# EAGLE design telemetry-phoenix (EAGLE 7.7.0)
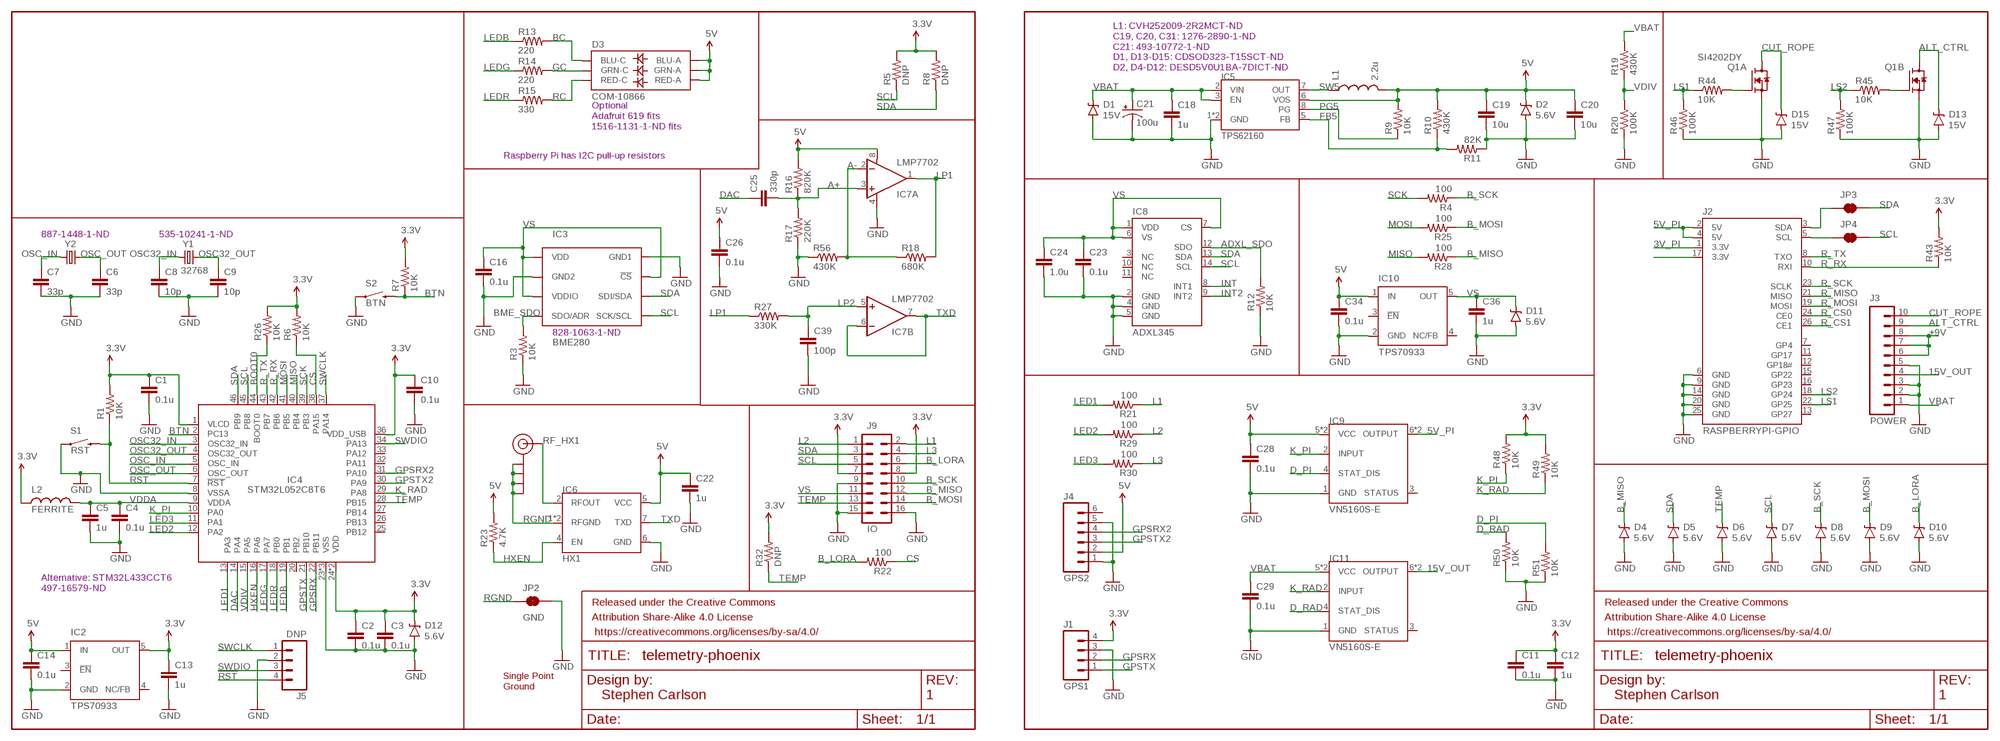
[diagram p0: schematic, sheet 1]

## Parts
C1  0.1u  CAP0805  [0805]
C2  0.1u  CAP0805  [0805]
C3  0.1u  CAP0805  [0805]
C4  0.1u  CAP0805  [0805]
C5  1u  CAP0805  [0805]
C6  33p  CAP0805  [0805]
C7  33p  CAP0805  [0805]
C8  10p  CAP0805  [0805]
C9  10p  CAP0805  [0805]
C10  0.1u  CAP0805  [0805]
C11  0.1u  CAP0805  [0805]
C12  1u  CAP0805  [0805]
C13  1u  CAP0805  [0805]
C14  0.1u  CAP0805  [0805]
C16  0.1u  CAP0805  [0805]
C18  1u  CAP0805  [0805]
C19  10u  CAP0805  [0805]
C20  10u  CAP0805  [0805]
C21  100u  CAP_POLE  [PANASONIC_E]
C22  1u  CAP0805  [0805]
C23  0.1u  CAP0805  [0805]
C24  1.0u  CAP0805  [0805]
C25  330p  CAP0805  [0805]
C26  0.1u  CAP0805  [0805]
C28  0.1u  CAP0805  [0805]
C29  0.1u  CAP0805  [0805]
C34  0.1u  CAP0805  [0805]
C36  1u  CAP0805  [0805]
C39  100p  CAP0805  [0805]
D1  15V  DIODE-ZENER5.6V  [SOD-323]
D2  5.6V  DIODE-ZENER5.6V  [SOD-323]
D3  COM-10866  LED-TRICOLOR-5050NO_IC  [LED-TRICOLOR-5050]
D4  5.6V  DIODE-ZENER5.6V  [SOD-323]
D5  5.6V  DIODE-ZENER5.6V  [SOD-323]
D6  5.6V  DIODE-ZENER5.6V  [SOD-323]
D7  5.6V  DIODE-ZENER5.6V  [SOD-323]
D8  5.6V  DIODE-ZENER5.6V  [SOD-323]
D9  5.6V  DIODE-ZENER5.6V  [SOD-323]
D10  5.6V  DIODE-ZENER5.6V  [SOD-323]
D11  5.6V  DIODE-ZENER5.6V  [SOD-323]
D12  5.6V  DIODE-ZENER5.6V  [SOD-323]
D13  15V  DIODE-ZENER5.6V  [SOD-323]
D15  15V  DIODE-ZENER5.6V  [SOD-323]
FRAME1  FRAME-LETTERNO_PACKAGE  [DUMMY]
FRAME2  FRAME-LETTERNO_PACKAGE  [DUMMY]
IC2  TPS70933  TPS77033  [SOT23-DBV]
IC3  BME280  [BME280_LGA]
IC4  STM32L052C8T6  STM32L07C  [TQFP48]
IC5  TPS62160  [MSOP8]
IC6  HX1  [HX1]
IC7  LMP7702  OPAMP-DUALU  [SO08]
IC8  ADXL345  [LGA14]
IC9  VN5160S-E  [SO8]
IC10  TPS70933  TPS77033  [SOT23-DBV]
IC11  VN5160S-E  [SO8]
J1  GPS1  M04PTH  [1X04]
J2  RASPBERRYPI-GPIO  [2X13-PI]
J3  POWER  1X10  [1X10_SCREW]
J4  GPS2  M06SMD-1MM  [1X06-1MM]
J5  DNP  M04LOCK  [1X04_LOCK]
J6  SMA_EDGE  [SMA-EDGE]
J9  IO  M08X2  [2X8]
JP2  GND  JUMPER-PAD-2-NC_BY_TRACE  [PAD-JUMPER-2-NC_BY_TRACE_YES_SILK]
JP3  SDA  JUMPER-PAD-2-NC_BY_TRACE  [PAD-JUMPER-2-NC_BY_TRACE_YES_SILK]
JP4  SCL  JUMPER-PAD-2-NC_BY_TRACE  [PAD-JUMPER-2-NC_BY_TRACE_YES_SILK]
L1  2.2u  INDUCTOR1008  [1008]
L2  FERRITE  INDUCTOR1206  [1206]
Q1  SI4202DY  [SO8]
R1  10K  RESISTOR0805-RES  [0805]
R3  10K  RESISTOR0805-RES  [0805]
R4  100  RESISTOR0805-RES  [0805]
R5  DNP  RESISTOR0805-RES  [0805]
R6  10K  RESISTOR0805-RES  [0805]
R7  10K  RESISTOR0805-RES  [0805]
R8  DNP  RESISTOR0805-RES  [0805]
R9  10K  RESISTOR0805-RES  [0805]
R10  430K  RESISTOR0805-RES  [0805]
R11  82K  RESISTOR0805-RES  [0805]
R12  10K  RESISTOR0805-RES  [0805]
R13  220  RESISTOR0805-RES  [0805]
R14  220  RESISTOR0805-RES  [0805]
R15  330  RESISTOR0805-RES  [0805]
R16  820K  RESISTOR0805-RES  [0805]
R17  220K  RESISTOR0805-RES  [0805]
R18  680K  RESISTOR0805-RES  [0805]
R19  430K  RESISTOR0805-RES  [0805]
R20  100K  RESISTOR0805-RES  [0805]
R21  100  RESISTOR0805-RES  [0805]
R22  100  RESISTOR0805-RES  [0805]
R23  4.7K  RESISTOR0805-RES  [0805]
R25  100  RESISTOR0805-RES  [0805]
R26  10K  RESISTOR0805-RES  [0805]
R27  330K  RESISTOR0805-RES  [0805]
R28  100  RESISTOR0805-RES  [0805]
R29  100  RESISTOR0805-RES  [0805]
R30  100  RESISTOR0805-RES  [0805]
R32  DNP  RESISTOR0805-RES  [0805]
R43  10K  RESISTOR0805-RES  [0805]
R44  10K  RESISTOR0805-RES  [0805]
R45  10K  RESISTOR0805-RES  [0805]
R46  100K  RESISTOR0805-RES  [0805]
R47  100K  RESISTOR0805-RES  [0805]
R48  10K  RESISTOR0805-RES  [0805]
R49  10K  RESISTOR0805-RES  [0805]
R50  10K  RESISTOR0805-RES  [0805]
R51  10K  RESISTOR0805-RES  [0805]
R56  430K  RESISTOR0805-RES  [0805]
S1  RST  SWITCH  [TACTILE-PTH-THIN]
S2  BTN  SWITCH  [TACTILE-PTH-THIN]
Y1  32768  CRYSTAL  [ABS25]
Y2  8M  CRYSTALTXC-7A  [CRYSTAL-TXC-7A]

## Nets
3.3V: C1.1 C2.1 C3.1 C10.1 C11.1 C12.1 C13.1 D12.C IC2.5(OUT) IC4.1(VLCD) IC4.24(VDD) IC4.36(VDD_USB) IC4.48(VDD) J1.4 J9.7 J9.8 L2.1 R1.2 R5.2 R6.2 R7.2 R8.2 R26.2 R32.2 R43.2 R48.2 R49.2
3V_PI: J2.1(3.3V)
3V_PI2: J2.17(3.3V)
5V: C14.1 C19.1 C20.1 C22.1 C26.1 C28.1 C34.1 D2.C D3.1(GRN-A) D3.2(RED-A) D3.3(BLU-A) IC2.1(IN) IC5.6(VOS) IC6.5(VCC) IC7.8(A:V+) IC9.5(VCC) IC9.8(VCC) IC10.1(IN) J4.2 L1.2 R9.2 R10.2 R16.2 R23.2
5V_PI: IC9.6(OUTPUT) IC9.7(OUTPUT) J2.2(5V) J2.4(5V)
15V_OUT: IC11.6(OUTPUT) IC11.7(OUTPUT) J3.4
!RST!: IC4.7(!RST!) J5.4 R1.1 S1.2
+9V: J3.6 J3.7 J3.8
A+: C25.2 IC7.3(A:+IN) R16.1 R17.2
A-: IC7.2(A:-IN) R18.1 R56.2
ACB: Q1.4(B:G) R45.2
ADXL_SDO: IC8.12(SDO) R12.2
ALT_CTRL: D13.C J3.9 Q1.5(B:D) Q1.6(B:D)
B_LORA: D10.C J9.6 R22.2
B_MISO: D4.C J9.12 R28.1
B_MOSI: D9.C J9.14 R25.1
B_SCK: D8.C J9.10 R4.1
BC: D3.4(BLU-C) R13.2
BME_SDO: IC3.P$5(SDO/ADR) R3.2
BOOT0: IC4.44(BOOT0) R26.1
BTN: IC4.2(PC13) R7.1 S2.2
CRB: Q1.2(A:G) R44.2
CS: IC4.38(PA15) R6.1 R22.1
CUT_ROPE: D15.C J3.10 Q1.7(A:D) Q1.8(A:D)
D_PI: IC9.4(STAT_DIS) R51.2
D_RAD: IC11.4(STAT_DIS) R50.2
DAC: C25.1 IC4.14(PA4)
FB5: IC5.5(FB) R10.1 R11.2
GC: D3.6(GRN-C) R14.2
GND: C1.2 C2.2 C3.2 C4.2 C5.2 C6.2 C7.2 C8.2 C9.2 C10.2 C11.2 C12.2 C13.2 C14.2 C16.2 C18.2 C19.2 C20.2 C21.- C22.2 C23.2 C24.2 C26.2 C28.2 C29.2 C34.2 C36.2 C39.2 D1.A D2.A D4.A D5.A D6.A D7.A D8.A D9.A D10.A D11.A D12.A D13.A D15.A IC2.2(GND) IC3.P$1(GND1) IC3.P$7(GND2) IC4.8(VSSA) IC4.23(VSS) IC4.35(VSS) IC4.47(VSS) IC5.1(GND) IC5.4(GND) IC6.6(GND) IC7.4(A:V-) IC8.2(GND) IC8.4(GND) IC8.5(GND) IC9.1(GND) IC10.2(GND) IC11.1(GND) J1.3 J2.6(GND) J2.9(GND) J2.14(GND) J2.20(GND) J2.25(GND) J3.2 J3.3 J3.5 J4.1 J4.5 J5.2 J9.9 J9.15 J9.16 JP2.2 Q1.1(A:S) Q1.3(B:S) R3.1 R11.1 R12.1 R17.1 R20.1 R46.1 R47.1 R50.1 R51.1 R56.1 S1.1 S2.1
GPSRX: IC4.22(PB11) J1.2
GPSRX2: IC4.31(PA10) J4.4
GPSTX: IC4.21(PB10) J1.1
GPSTX2: IC4.30(PA9) J4.3
HXEN: IC4.16(PA6) IC6.4(EN) R23.1
INT: IC8.8(INT1)
INT2: IC8.9(INT2)
K_PI: IC4.10(PA0) IC9.2(INPUT) R48.1
K_RAD: IC4.29(PA8) IC11.2(INPUT) R49.1
L1: J9.2 R21.1
L2: J9.1 R29.1
L3: J9.4 R30.1
LED1: IC4.13(PA3) R21.2
LED2: IC4.12(PA2) R29.2
LED3: IC4.11(PA1) R30.2
LEDB: IC4.19(PB1) R13.1
LEDG: IC4.17(PA7) R14.1
LEDR: IC4.18(PB0) R15.1
LP1: IC7.1(A:OUT) R18.2 R27.1
LP2: C39.1 IC7.5(B:+IN) R27.2
LS1: J2.22(GP25) R44.1 R46.2
LS2: J2.18(GP24) R45.1 R47.2
MISO: IC4.40(PB4) R28.2
MOSI: IC4.41(PB5) R25.2
OSC32_IN: C8.1 IC4.3(OSC32_IN) Y1.1
OSC32_OUT: C9.1 IC4.4(OSC32_OUT) Y1.4
OSC_IN: C7.1 IC4.5(OSC_IN) Y2.P$1
OSC_OUT: C6.1 IC4.6(OSC_OUT) Y2.P$2
PG5: IC5.8(PG) R9.1
R_CS0: J2.24(CE0)
R_CS1: J2.26(CE1)
R_MISO: J2.21(MISO)
R_MOSI: J2.19(MOSI)
R_RX: IC4.42(PB6) J2.10(RXI) R43.1
R_SCK: J2.23(SCLK)
R_SCL: J2.5(SCL) JP4.1
R_SDA: J2.3(SDA) JP3.1
R_TX: IC4.43(PB7) J2.8(TXO)
RC: D3.5(RED-C) R15.2
RF_HX1: IC6.2(RFOUT) J6.SIG(SIGNAL)
RGND: IC6.1(RFGND) IC6.3(RFGND) J6.GND@0(GND) J6.GND@1(GND) J6.GND@2(GND) J6.GND@3(GND) JP2.1
SCK: IC4.39(PB3) R4.2
SCL: D7.C IC3.P$4(SCK/SCL) IC4.45(PB8) IC8.14(SCL) J9.5 JP4.2 R5.1
SDA: D5.C IC3.P$3(SDI/SDA) IC4.46(PB9) IC8.13(SDA) J9.3 JP3.2 R8.1
SW5: IC5.7(OUT) L1.1
SWCLK: IC4.37(PA14) J5.1
SWDIO: IC4.34(PA13) J5.3
TEMP: D6.C IC4.28(PB15) J9.13 R32.1
TXD: IC6.7(TXD) IC7.6(B:-IN) IC7.7(B:OUT)
VBAT: C18.1 C21.+ C29.1 D1.C IC5.2(VIN) IC5.3(EN) IC11.5(VCC) IC11.8(VCC) J3.1 R19.2
VDDA: C4.1 C5.1 IC4.9(VDDA) L2.2
VDIV: IC4.15(PA5) R19.1 R20.2
VS: C16.1 C23.1 C24.1 C36.1 D11.C IC3.P$2(!CS) IC3.P$6(VDDIO) IC3.P$8(VDD) IC8.1(VDD) IC8.6(VS) IC8.7(CS) IC10.5(OUT) J9.11
Unconnected: IC2.3(!EN) IC2.4(NC/FB) IC4.20(PB2) IC4.25(PB12) IC4.26(PB13) IC4.27(PB14) IC4.32(PA11) IC4.33(PA12) IC8.3(NC) IC8.10(NC) IC8.11(NC) IC9.3(STATUS) IC10.3(!EN) IC10.4(NC/FB) IC11.3(STATUS) J2.7(GP4) J2.11(GP17) J2.12(GP18#) J2.13(GP27) J2.15(GP22) J2.16(GP23) J4.6

## Notes on the sheet
- L1: CVH252009-2R2MCT-ND
  C19, C20, C31: 1276-2890-1-ND
  C21: 493-10772-1-ND
  D1, D13-D15: CDSOD323-T15SCT-ND 
  D2, D4-D12: DESD5V0U1BA-7DICT-ND
- Optional
  Adafruit 619 fits
  1516-1131-1-ND fits
- Raspberry Pi has I2C pull-up resistors
- 887-1448-1-ND | 535-10241-1-ND
- 828-1063-1-ND
- Alternative: STM32L433CCT6
  497-16579-ND
- Single Point
  Ground
- Stephen Carlson | 1 | Stephen Carlson | 1

## Library data of the parts
C1-C14 C16 C18-C20 C22-C26 C28 C29 C34 C36 C39 = SparkFun-Passives:CAP: Capacitor Standard 0603 ceramic capacitor, and 0.1" leaded capacitor.
C21 = SparkFun-Passives:CAP_POL: Capacitor Polarized These are standard SMD and PTH capacitors. Normally 10uF, 47uF, and 100uF in electrolytic and tantalum varieties. Always verify the external diameter of the through hole cap, it varies with capacity, voltage, and manufacturer. The EIA devices should be standard.
D1 D13 D15 = SparkFun-DiscreteSemi:DIODE-ZENER: Zener Diode Production Part - 8199 3.4V Zener Voltage; PROD_ID: DIO-12442; VALUE: 5.6V
D2 D4-D12 = SparkFun-DiscreteSemi:DIODE-ZENER: Zener Diode Production Part - 8199 3.4V Zener Voltage; PROD_ID: DIO-12442
D3 = SparkFun-LED:LED-TRICOLOR-5050
FRAME1 FRAME2 = SparkFun-Aesthetics:FRAME-LETTER: Schematic Frame Standard 8.5x11 US Letter frame; DESIGNER: Nobody; VERSION: v01
IC2 IC10 = texas:TPS770*: ULTRALOW-POWER 50-mA LOW-DROPOUT LINEAR REGULATORS 50-mA Low-Dropout Regulator Source: http://focus.ti.com/lit/ds/symlink/tps77001.pdf; MF: TEXAS INSTRUMENTS; MPN: TPS77033DBVT; OC_FARNELL: 8461570; OC_NEWARK: 77C1187
IC3 = BME280ComponentLibrary:BME280; PROD_ID: IC-13090
IC4 = stm32xx:STM32L07*C: STM32L07XC STM32L07X series in LQFP-48 package
IC5 = HAB:TPS62160: TPS62160 Adjustable switch-mode D-CAP2 regulator
IC6 = HAB:HX1: Radiometrix HX1 High-power VHF Narrow Band 300 mW Transmitter
IC7 = SparkFun-AnalogIC:OPAMP-DUAL: Generic op-amp footprint
IC8 = SparkFun-Sensors:ADXL345: 3-axis SPI/I2C 2/4/8/16g accelerometer
IC9 IC11 = HAB:VN5160S-E: VN5160S-E Single channel high side driver for automotive applications
J1 J5 = SparkFun-Connectors:M04: Header 4 Standard 4-pin 0.1" header. Use with straight break away headers (SKU : PRT-00116), right angle break away headers (PRT-00553), swiss pins (PRT-00743), machine pins (PRT-00117), and female headers (PRT-00115). Molex polarized connector foot print use with SKU : PRT-08231 with associated crimp pins and housings. 1MM SMD Version SKU: PRT-10208; PROD_ID: CONN-09696
J2 = HAB:RASPBERRYPI-GPIO: RASPBERRY PI I/O HEADER As defined for the Revision 2 Pi.
J3 = HAB:1X10: 1X10 10-pin header
J4 = SparkFun-Connectors:M06: Header 6 Standard 6-pin 0.1" header. Use with straight break away headers (SKU : PRT-00116), right angle break away headers (PRT-00553), swiss pins (PRT-00743), machine pins (PRT-00117), and female headers (PRT-00115). Molex polarized connector foot print use with SKU : PRT-08094 with associated crimp pins and housings. NOTES ON THE VARIANTS LOCK and LOCK_LONGPADS... This footprint was designed to help hold the alignment of a through-hole component (i.e. 6-pin header) while soldering it into place. You may notice that each hole has been shifted either up or down by 0.005 of an inch from it's more standard position (which is a perfectly straight line). This slight alteration caused the pins (the squares in the middle) to touch the edges of the holes. Because they are alternating, it causes a "brace" to hold the component in place. 0.005 has proven to be the perfect amount of "off-center" position when using our standard breakaway headers. Although looks a little odd when you look at the bare footprint, once you have a header in there, the alteration is very hard to notice. Also,if you push a header all the way into place, it is covered up entirely on the bottom side. This idea of altering the position of holes to aid alignment will be further integrated into the Sparkfun Library for other footprints. It can help hold any component with 3 or more connection pins.
J6 = SparkFun-Connectors:SMA_EDGE: SMA Antenna Connector End launch SMA connector. The paste layer has been removed so that the connector can be hand soldered onto the board after reflow.
J9 = SparkFun-Connectors:M08X2: .1" headers, two rows of 8 each
JP2-JP4 = SparkFun-Passives:JUMPER-PAD-2-NC_BY_TRACE
L1 L2 = HAB:INDUCTOR: INDUCTOR Standard inductor, with some new packages Why do inductors never come in standard packages!?
Q1 = HAB:SI4202DY: SI4202DY Dual N-Channel 30V (D-S) MOSFET
R1 R3-R23 R25-R30 R32 R43-R51 R56 = SparkFun-Passives:RESISTOR: Resistor Basic schematic elements and footprints for 0603, 1206, and PTH resistors.
S1 S2 = HAB:SWITCH: SWITCH Package for the MJTP1250, a thinner and lighter PTH push button switch.
Y1 = HAB:CRYSTAL: CRYSTAL Crystal oscillators in packages not in SparkFun-FreqCtl
Y2 = SparkFun-FreqCtrl:CRYSTAL: Various standard crystals. Proven footprints.

## Board
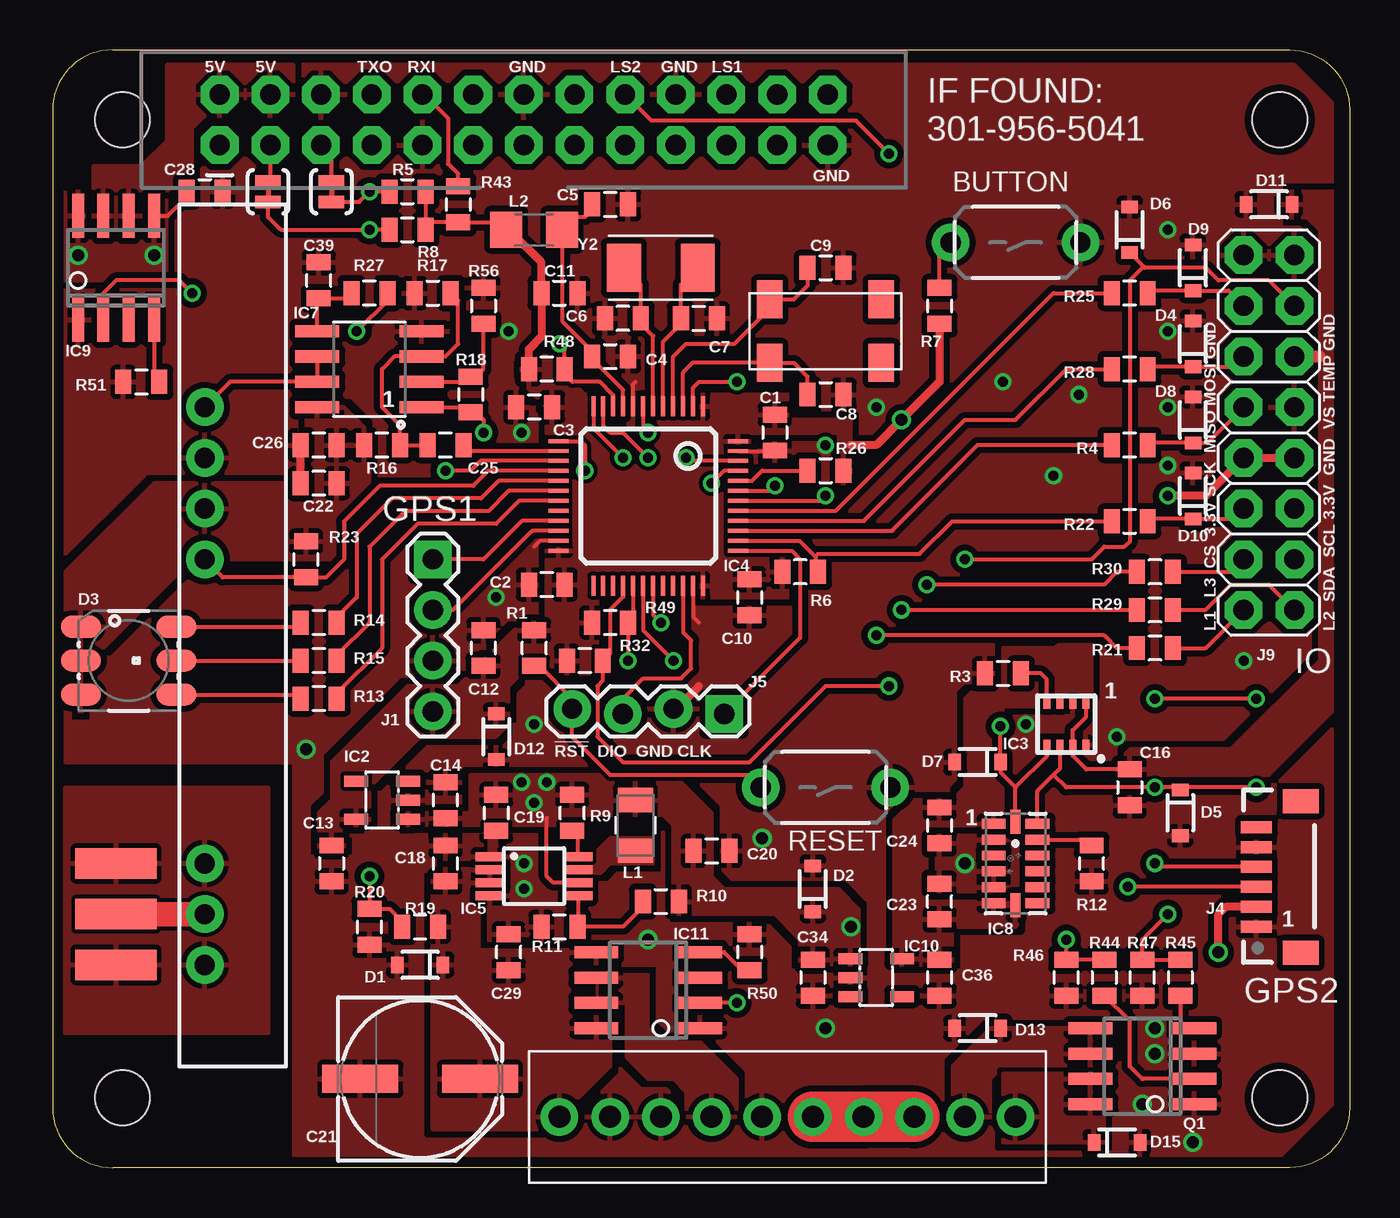
[diagram p1: board, top side]
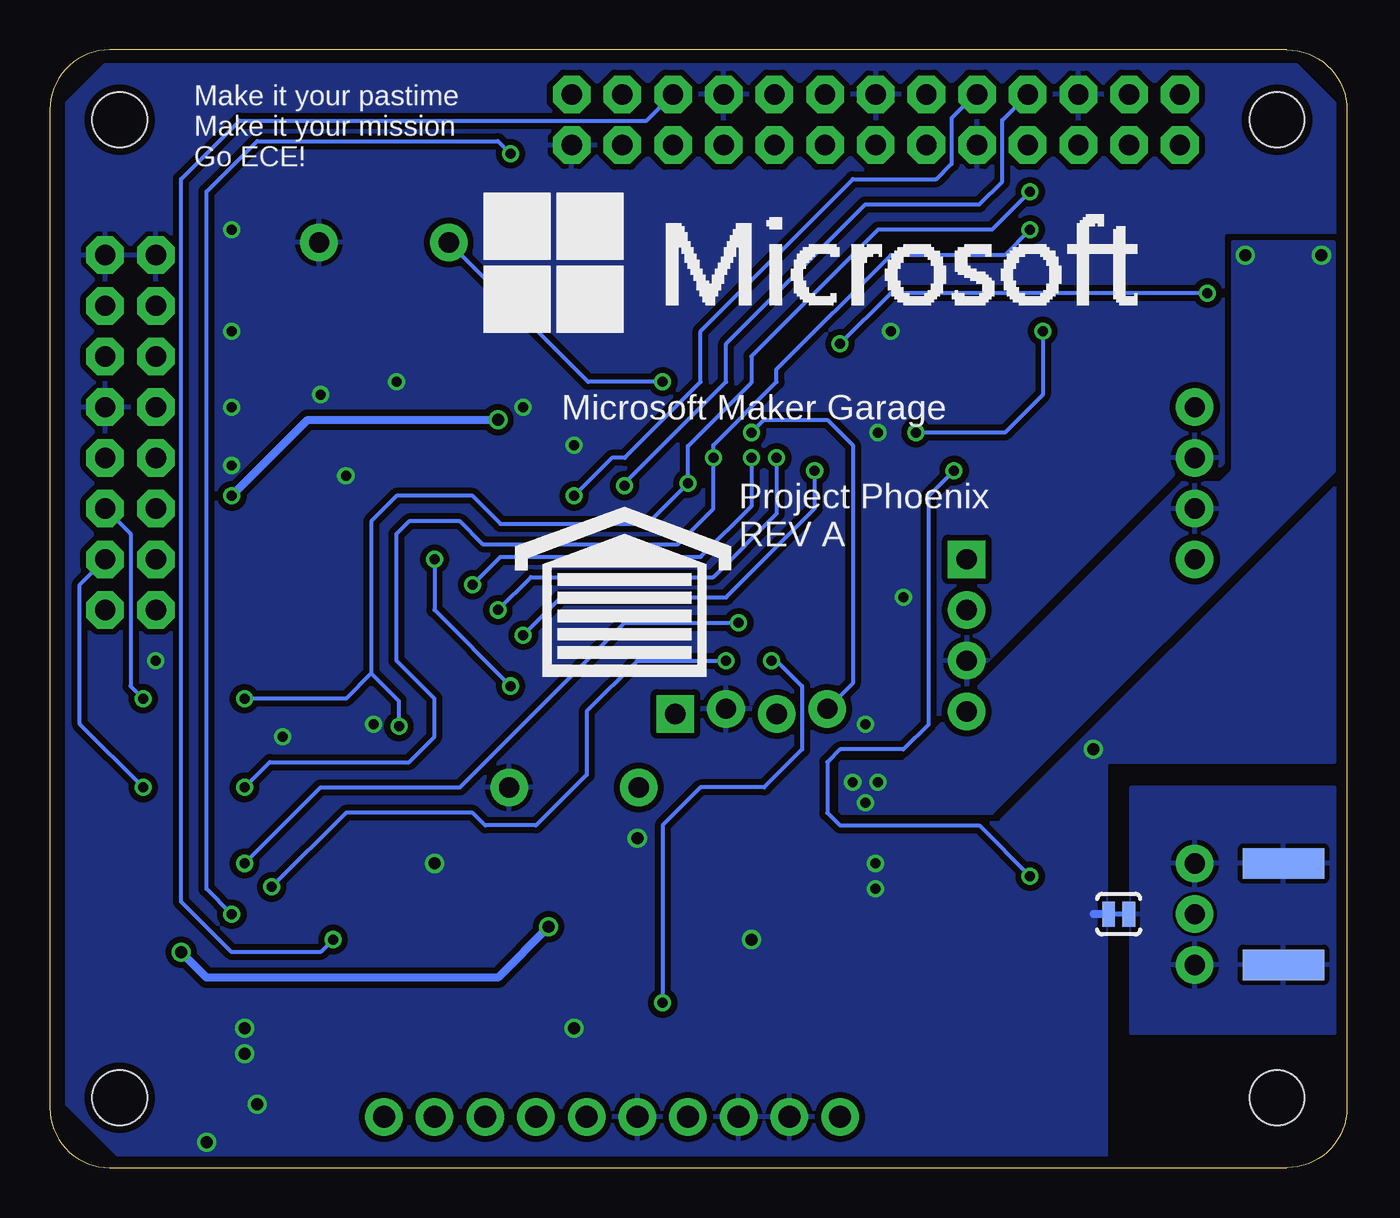
[diagram p2: board, bottom side, seen from below]

Size 65 x 56 mm. Coordinates in mm from the lower left corner, seen from the top.
Outline: 0,53 0,3 arc90 3,0 62,0 arc90 65,3 65,53 arc90 62,56 3,56 arc90 0,53
Copper layers (1*16): Top 0.0356mm / dielectric 1.5011mm / Bottom 0.0356mm
Design rules "LaenPCBOrder *": minimum track width 6mil, minimum drill 13mil, track to track 6mil, track to pad 6mil, pad to pad 6mil, via to via 6mil, smd to smd 6mil, copper to edge 15mil, drill to drill 6mil, minimum pad ring 7mil, minimum via ring 7mil, stop-mask expansion 2.5mil, vias tented up to drill 0mil, thermal gap 10mil
Holes 2.75 mm at 3.5,52.5 61.5,3.5 3.5,3.5 61.5,52.5
tKeepout: area 0.5,49.5 to 6.5,55.5; area 0.5,0.5 to 6.5,6.5; area 58.5,0.5 to 64.5,6.5; area 58.5,49.5 to 64.5,55.5

### Footprints (pad centres in the part's own frame; a part is rotated, then mirrored left to right if it is on the bottom)
0805 = smd 0.8 x 1.2: 1 -0.9,0; 2 0.9,0
PANASONIC_E = smd 3.8 x 1.4: + 3,0; - -3,0
SOD-323 = smd 0.63 x 0.83: A 1.15,0; C -1.15,0
LED-TRICOLOR-5050 = smd 2 x 1.1: 1 -2.4,1.7; 2 -2.4,0; 3 -2.4,-1.7; 4 2.4,-1.7; 5 2.4,0; 6 2.4,1.7
SOT23-DBV = smd 0.55 x 1.2: 1 -0.95,-1.3; 2 0,-1.3; 3 0.95,-1.3; 4 0.95,1.3; 5 -0.95,1.3
BME280_LGA = smd 0.5 x 0.35: P$1 1.025,0.975; P$2 1.025,0.325; P$3 1.025,-0.325; P$4 1.025,-0.975; P$5 -1.025,-0.975; P$6 -1.025,-0.325; P$7 -1.025,0.325; P$8 -1.025,0.975
TQFP48 = smd 0.2 x 1: 1 -2.75,-4.5; 2 -2.25,-4.5; 3 -1.75,-4.5; 4 -1.25,-4.5; 5 -0.75,-4.5; 6 -0.25,-4.5; 7 0.25,-4.5; 8 0.75,-4.5; 9 1.25,-4.5; 10 1.75,-4.5; 11 2.25,-4.5; 12 2.75,-4.5; 25 2.75,4.5; 26 2.25,4.5; 27 1.75,4.5; 28 1.25,4.5; 29 0.75,4.5; 30 0.25,4.5; 31 -0.25,4.5; 32 -0.75,4.5; 33 -1.25,4.5; 34 -1.75,4.5; 35 -2.25,4.5; 36 -2.75,4.5 | smd 1 x 0.2: 13 4.5,-2.75; 14 4.5,-2.25; 15 4.5,-1.75; 16 4.5,-1.25; 17 4.5,-0.75; 18 4.5,-0.25; 19 4.5,0.25; 20 4.5,0.75; 21 4.5,1.25; 22 4.5,1.75; 23 4.5,2.25; 24 4.5,2.75; 37 -4.5,2.75; 38 -4.5,2.25; 39 -4.5,1.75; 40 -4.5,1.25; 41 -4.5,0.75; 42 -4.5,0.25; 43 -4.5,-0.25; 44 -4.5,-0.75; 45 -4.5,-1.25; 46 -4.5,-1.75; 47 -4.5,-2.25; 48 -4.5,-2.75
MSOP8 = smd 0.45 x 1.45: 1 -0.975,-2.2; 2 -0.325,-2.2; 3 0.325,-2.2; 4 0.975,-2.2; 5 0.975,2.2; 6 0.325,2.2; 7 -0.325,2.2; 8 -0.975,2.2
HX1 = drill 1.016 pad 1.88: 1 0,0; 2 2.54,0; 3 5.08,0; 4 20.32,0; 5 22.86,0; 6 25.4,0; 7 27.94,0
SO08 = smd 0.61 x 2.21: 1 -1.905,-2.616; 2 -0.635,-2.616; 3 0.635,-2.616; 4 1.905,-2.616; 5 1.905,2.616; 6 0.635,2.616; 7 -0.635,2.616; 8 -1.905,2.616
LGA14 = smd 0.5 x 1.2: 1 2,1.1; 2 1.2,1.1; 3 0.4,1.1; 4 -0.4,1.1; 5 -1.2,1.1; 6 -2,1.1; 8 -2,-1.1; 9 -1.2,-1.1; 10 -0.4,-1.1; 11 0.4,-1.1; 12 1.2,-1.1; 13 2,-1.1 | smd 1.2 x 0.5: 7 -2.1,0; 14 2.1,0
SO8 = smd 0.6 x 2.2: 1 -1.905,-2.6; 2 -0.635,-2.6; 3 0.635,-2.6; 4 1.905,-2.6; 5 1.905,2.6; 6 0.635,2.6; 7 -0.635,2.6; 8 -1.905,2.6
1X04 = drill 1.016 pad 1.88 square: 1 0,0 | drill 1.016 pad 1.88: 2 2.54,0; 3 5.08,0; 4 7.62,0
2X13-PI = drill 1.016 pad 1.88 octagon: 1 -1.27,15.24; 2 1.27,15.24; 3 -1.27,12.7; 4 1.27,12.7; 5 -1.27,10.16; 6 1.27,10.16; 7 -1.27,7.62; 8 1.27,7.62; 9 -1.27,5.08; 10 1.27,5.08; 11 -1.27,2.54; 12 1.27,2.54; 13 -1.27,0; 14 1.27,0; 15 -1.27,-2.54; 16 1.27,-2.54; 17 -1.27,-5.08; 18 1.27,-5.08; 19 -1.27,-7.62; 20 1.27,-7.62; 21 -1.27,-10.16; 22 1.27,-10.16; 23 -1.27,-12.7; 24 1.27,-12.7; 25 -1.27,-15.24; 26 1.27,-15.24
1X10_SCREW = drill 1.1 pad 1.88: 1 0,0; 2 2.54,0; 3 5.08,0; 4 7.62,0; 5 10.16,0; 6 12.7,0; 7 15.24,0; 8 17.78,0; 9 20.32,0; 10 22.86,0
1X06-1MM = smd 0.6 x 1.55: 1 -2.54,1.27; 2 -1.54,1.27; 3 -0.54,1.27; 4 0.46,1.27; 5 1.46,1.27; 6 2.46,1.27 | smd 1.2 x 1.8: P$1 -3.84,-0.955; P$2 3.76,-0.955
1X04_LOCK = drill 1.016 pad 1.88 square: 1 0,0.127 | drill 1.016 pad 1.88: 2 2.54,-0.127; 3 5.08,0.127; 4 7.62,-0.127
SMA-EDGE = smd 1.524 x 4.064: GND@0 0,0; GND@1 5.08,0; SIG 2.54,0 | smd 1.524 x 4.064 bottom: GND@2 0,0; GND@3 5.08,0
2X8 = drill 1.016 pad 1.88 octagon: 1 0,0; 2 0,2.54; 3 2.54,0; 4 2.54,2.54; 5 5.08,0; 6 5.08,2.54; 7 7.62,0; 8 7.62,2.54; 9 10.16,0; 10 10.16,2.54; 11 12.7,0; 12 12.7,2.54; 13 15.24,0; 14 15.24,2.54; 15 17.78,0; 16 17.78,2.54
PAD-JUMPER-2-NC_BY_TRACE_YES_SILK = smd 0.635 x 1.27: 1 -0.508,0; 2 0.508,0
1008 = smd 1.753 x 1.219: 1 0,1.27; 2 0,-1.27
1206 = smd 1.6 x 1.8: 1 -1.4,0; 2 1.4,0
TACTILE-PTH-THIN = drill 1.016 pad 1.88: 1 -3.251,0; 2 3.251,0
ABS25 = smd 1.27 x 1.905: 1 -2.794,-1.587; 2 2.794,-1.587; 3 2.794,1.587; 4 -2.794,1.587
CRYSTAL-TXC-7A = smd 1.7 x 2.4: P$1 1.85,0; P$2 -1.85,0

### Placement (x,y rotation side)
C1  36.2,36.83 270 top
C2  24.77,29.21 180 top
C3  24.13,38.1 180 top
C4  27.94,40.64 0 top
C5  27.94,48.26 0 top
C6  28.57,42.55 180 top
C7  32.38,42.55 0 top
C8  38.73,38.73 0 top
C9  38.73,45.09 0 top
C10  34.92,28.57 270 top
C11  25.4,43.81 0 top
C12  21.59,26.04 90 top
C13  13.97,15.24 270 top
C14  19.68,18.41 90 top
C16  53.98,19.05 270 top
C18  19.68,15.24 90 top
C19  22.23,17.78 270 top
C20  33.02,15.88 0 top
C21  18.41,4.45 0 top
C22  13.34,34.29 180 top
C23  44.45,13.34 90 top
C24  44.45,17.14 270 top
C25  19.68,36.2 180 top
C26  13.34,36.2 180 top
C28  7.62,48.9 0 top
C29  22.86,10.79 90 top
C34  38.1,9.53 270 top
C36  44.45,9.53 270 top
C39  13.34,44.45 90 top
D1  18.41,10.16 180 top
D2  38.1,13.97 90 top
D3  3.81,25.4 0 top
D4  57.15,41.27 90 top
D5  56.52,17.78 270 top
D6  53.98,46.99 90 top
D7  46.35,20.32 180 top
D8  57.15,37.47 90 top
D9  57.15,45.09 90 top
D10  57.15,33.66 90 top
D11  60.96,48.26 180 top
D12  22.23,21.59 270 top
D13  46.35,6.99 180 top
D15  53.34,1.27 0 top
FRAME1  0,57.15 0 top
FRAME2  1.27,57.15 0 top
IC2  16.51,18.41 90 top
IC3  50.8,22.23 270 top
IC4  29.84,33.66 180 top
IC5  24.13,14.61 270 top
IC6  7.62,10.16 90 top
IC7  15.88,40.01 90 top
IC8  48.26,15.24 90 top
IC9  3.17,45.09 0 top
IC10  41.27,9.53 270 top
IC11  29.84,8.89 90 top
J1  19.05,30.48 270 top
J2  23.61,52.5 90 top
J3  25.4,2.54 0 top
J4  61.59,14.61 90 top
J5  33.66,22.86 180 top
J6  3.17,10.16 90 top
J9  62.23,27.94 90 top
JP2  11.43,12.7 180 bottom
JP3  10.79,48.9 270 top
JP4  13.97,48.9 270 top
L1  29.21,17.14 180 top
L2  24.13,46.99 0 top
Q1  54.61,5.08 90 top
R1  24.13,26.04 90 top
R3  47.62,24.77 0 top
R4  53.98,36.2 180 top
R5  17.78,48.9 0 top
R6  37.47,29.84 180 top
R7  44.45,43.18 270 top
R8  17.78,46.99 0 top
R9  26.04,17.78 90 top
R10  30.48,13.34 0 top
R11  25.4,12.06 0 top
R12  52.07,15.24 90 top
R13  13.34,23.5 180 top
R14  13.34,27.3 180 top
R15  13.34,25.4 180 top
R16  16.51,36.2 180 top
R17  19.05,43.81 0 top
R18  20.95,38.73 270 top
R19  18.41,12.06 0 top
R20  15.88,12.06 90 top
R21  55.24,26.04 180 top
R22  53.98,32.38 0 top
R23  12.7,30.48 90 top
R25  53.98,43.81 180 top
R26  38.73,34.92 0 top
R27  15.88,43.81 180 top
R28  53.98,40.01 180 top
R29  55.24,27.94 180 top
R30  55.24,29.84 180 top
R32  26.67,25.4 180 top
R43  20.32,48.26 270 top
R44  52.7,9.53 270 top
R45  56.52,9.53 270 top
R46  50.8,9.53 90 top
R47  54.61,9.53 90 top
R48  24.77,40.01 180 top
R49  27.94,27.3 180 top
R50  34.92,10.79 270 top
R51  4.45,39.37 0 top
R56  21.59,43.18 270 top
S1  38.73,19.05 180 top
S2  48.26,46.35 180 top
U$1  [GARAGE]  36.2,27.94 0 bottom
U$2  [MSFT_LOGO]  24.13,45.09 0 bottom
Y1  38.73,41.91 0 top
Y2  30.48,45.09 0 top

### Tracks (layer width: path | path; a pad name or v marks a point on that pad's centre or on a via)
3.3V  (via drill 0.5, 0.6)
  Top 0.203: R5.2 R8.2 19.05,47.36 R43.2 22.36,47.36 L2.1
  Top 0.406: J9.7 J9.8 57.78,33.66 v55.88,33.66 | R7.2 44.45,39.37 v42.55,37.47 41.27,36.2 40.01,36.2 | R48.2 23.86,41.01 24.5,41.65 C11.1 24.5,45.35 22.86,46.99 L2.1
  Bottom 0.406: v55.88,33.66 52.07,37.47 v42.55,37.47
  pour Top (isolate 0.203, rank 3): 23.5,40.64 23.5,39.37 24.77,38.1 24.77,27.3 23.5,27.3 20.32,24.13 17.78,24.13 13.97,20.32 13.97,18.41 13.34,17.78 13.34,15.88 14.61,15.88 14.61,17.14 15.88,17.14 15.88,19.05 18.41,21.59 22.23,21.59 22.86,22.23 22.86,24.13 23.5,24.77 27.3,24.77 27.3,28.57 36.83,28.57 36.83,30.48 34.92,30.48 34.92,36.83 39.37,36.83 39.37,34.29 40.01,34.29 40.01,37.47 36.83,37.47 36.83,38.73 26.67,38.73 24.77,40.64
5V  (via drill 0.5, 0.6)
  Top 0.203: IC9.5 5.78,47.69 6.72,48.63 C28.1 | IC5.6 25.09,14.28 24.77,14.61 24.77,17.52
  Top 0.406: v58.42,10.79 58.42,12.7 58.78,13.06 J4.2
  Bottom 0.406: v40.01,12.06 42.55,9.53 57.15,9.53 v58.42,10.79
  other vias: 23.5,19.3 1.27,45.72 5.08,45.72 24.77,19.3 24.13,18.29
  pour Top (isolate 0.203, rank 2): 31.11,12.7 31.11,17.14 30.61,17.65 25.4,17.65 25.4,17.14 17.78,17.14 17.78,17.78 20.95,17.78 20.95,19.68 31.11,19.68 33.02,17.78 33.02,14.61 33.66,13.97 39.37,13.97 40.39,12.95 40.39,10.16 37.47,10.16 37.47,11.43 36.2,12.7
  pour Top (isolate 0.305, rank 3): 0.64,22.86 1.91,22.86 1.91,25.4 6.99,30.48 14.61,30.48 14.61,32.38 15.88,33.66 15.88,36.83 14.61,38.1 12.7,38.1 12.7,34.29 5.08,34.29 0.64,29.84
  pour Top (isolate 0.305, rank 3): 0.64,48.9 0.64,44.45 5.71,44.45 5.71,48.9
  pour Bottom (isolate 0.305, rank 3): 25.4,20.32 25.4,17.78 17.78,17.78 0.64,34.92 0.64,46.35 5.71,46.35 5.71,34.92 6.35,34.29 8.26,34.29 22.23,20.32
5V_PI
  pour Top (isolate 0.305, rank 2): 5.71,55.24 5.71,51.44 4.45,50.16 2.03,50.16 2.03,46.99 4.45,46.99 4.45,48.9 5.71,48.9 6.99,50.16 6.99,52.07 7.62,52.7 12.06,52.7 12.06,55.24
15V_OUT
  pour Top (isolate 0.305, rank 2): 27.3,9.65 27.3,8.26 28.75,8.26 28.75,5.54 29.84,4.45 31.11,4.45 31.75,3.81 31.75,2.54 34.29,2.54 34.29,4.45 32.38,6.35 30.48,6.35 29.84,6.99 29.84,9.65
!RST!  (via drill 0.5)
  Top 0.203: R1.1 24.39,25.14 26.04,23.5 J5.4 26.04,21.59 27.94,19.68 34.85,19.68 S1.2 | IC4.7 29.59,37.08 v29.84,36.83
  Bottom 0.203: v29.84,36.83 29.21,37.47 26.04,37.47 24.77,36.2 24.77,24.26 J5.4
+9V
  Top 2.54: J3.6 J3.7 J3.8
A+
  Top 0.203: C25.2 R16.1 17.41,37.2 16.51,38.1 16.51,40.01 17.14,40.64 IC7.3 19.68,40.64 20.32,41.27 20.32,43.45 R17.2
A-
  Top 0.203: IC7.2 20.69,39.37 R18.1 21.22,39.63 21.59,40.01 R56.2
ACB
  Top 0.203: R45.2 56.52,6.99 Q1.4
ADXL_SDO
  Top 0.203: IC8.12 51.77,16.44 R12.2
ALT_CTRL
  pour Top (isolate 0.203, rank 3): 52.7,6.99 46.99,6.99 45.09,5.08 45.09,1.91 46.99,1.91 46.99,4.45 47.62,5.08 52.7,5.08
B_LORA
  Top 0.203: R22.2 54.99,32.51 D10.C 59.17,32.51 J9.6
B_MISO
  Top 0.203: R28.1 54.99,40.12 D4.C 59.17,40.12 J9.12
B_MOSI
  Top 0.203: J9.14 58.94,43.94 D9.C 54.99,43.94 R25.1
B_SCK
  Top 0.203: R4.1 54.99,36.31 D8.C 57.91,36.31 J9.10
BC
  Top 0.203: D3.4 12.23,23.7 R13.2
BME_SDO
  Top 0.203: IC3.P$5 49.83,24.47 49.53,24.77 R3.2
BOOT0
  Top 0.203: IC4.44 35.04,34.41 35.56,34.92 R26.1
BTN  (via drill 0.5)
  Top 0.203: IC4.2 32.09,39.08 32.38,39.37 v34.29,39.37 | R7.1 44.45,45.8 S2.2
  Bottom 0.203: v34.29,39.37 38.02,39.37 S2.2
CRB
  Top 0.203: Q1.2 54.61,4.45 53.98,5.08 53.98,7.36 R44.2
CS
  Top 0.203: IC4.38 37.44,31.41 38.23,30.61 | 38.23,30.61 38.37,30.75 43.45,30.75 45.09,32.38 R22.1 | 38.23,30.61 38.23,29.98 R6.1
CUT_ROPE
  pour Top (isolate 0.203, rank 2): 47.62,4.7 47.62,1.27 52.7,1.27 52.7,4.7
D_PI
  Top 0.203: IC9.4 5.08,39.63 R51.2
D_RAD
  Top 0.203: IC11.4 33.66,10.79 34.55,9.89 R50.2
DAC
  Top 0.203: IC4.14 20.88,35.91 C25.1
FB5
  Top 0.203: 26.33,12.1 28.61,12.1 29.58,13.07 R10.1 | IC5.5 26.33,12.1 | 26.33,12.1 R11.2
GC
  Top 0.203: D3.6 12.23,27.1 R14.2
GND  (via drill 0.5, 0.6)
  Top 0.203: IC4.47 36.17,35.91 C1.2 | IC4.8 29.09,39.26 29.21,39.37 | IC4.23 24.42,31.41 24.13,31.11 | IC4.35 32.09,27.59 32.38,27.3
  Top 0.406: C22.2 C26.2 | J5.2 31.11,22.86 32.38,24.13
  Bottom 0.406: JP2.2 12.7,12.7
  other vias: 55.24,5.71 55.24,6.99 54.61,3.17 57.15,1.27 12.7,20.95 23.5,36.83 22.86,41.91 29.84,11.43 38.73,6.99 35.56,16.51 45.72,15.24 38.73,36.2 41.27,38.1 53.34,21.59 55.88,35.18 55.88,38.1 55.88,41.91 55.88,46.99 24.13,22.23 22.23,28.57 48.77,22.23 51.44,38.73 47.62,39.37 50.16,34.67 59.69,25.4 23.62,15.24 23.62,13.97
  pour Top (isolate 0.305, rank 4): 7.62,55.24 7.62,50.16 5.71,48.26 5.71,46.35 0.64,46.35 0.64,20.32 12.06,20.32 12.06,0.64 61.59,0.64 64.14,3.17 64.14,53.34 62.23,55.24
  pour Bottom (isolate 0.305, rank 4): 2.54,55.24 0.64,53.34 0.64,20.32 12.06,20.32 12.06,0.64 61.59,0.64 64.14,3.17 64.14,53.34 62.23,55.24
  pour Top (isolate 0.203, rank 3, no thermals): 21.84,17.14 21.84,15.62 22.23,15.62 22.23,17.14
GPSRX
  Top 0.203: IC4.22 24.03,31.91 20.07,27.94 J1.2
GPSRX2  (via drill 0.5)
  Top 0.203: IC4.31 30.09,27.69 v30.48,27.3 | J4.4 55.42,15.06 v55.24,15.24
  Bottom 0.203: v55.24,15.24 51.44,19.05 44.45,19.05 36.2,27.3 v30.48,27.3
GPSTX
  Top 0.203: IC4.21 23.52,32.41 21.59,30.48 J1.1
GPSTX2  (via drill 0.5)
  Top 0.203: IC4.30 29.59,26.92 v31.11,25.4 | J4.3 v53.88,14.06
  Bottom 0.203: v31.11,25.4 35.56,25.4 38.1,22.86 38.1,19.68 40.64,17.14 43.18,17.14 43.81,17.78 50.16,17.78 v53.88,14.06
HXEN
  Top 0.203: IC6.4 8.52,29.58 R23.1 13.71,29.58 14.61,30.48 14.61,32.38 16.38,34.16 21.08,34.16 21.82,34.91 IC4.16
K_PI  (via drill 0.5)
  Top 0.203: IC4.10 28.09,38.71 27.43,39.37 26.04,39.37 25.66,39.74 R48.1 25.66,41.01 v25.4,41.27 | v6.99,43.81 6.35,44.45 3.17,44.45 2.54,43.81 IC9.2
  Bottom 0.203: v25.4,41.27 22.86,43.81 v6.99,43.81
K_RAD  (via drill 0.5)
  Top 0.203: IC4.29 29.09,27.56 R49.1 v28.84,25.4 | v34.29,8.26 IC11.2
  Bottom 0.203: v28.84,25.4 28.57,25.4 27.3,24.13 27.3,20.95 29.21,19.05 32.38,19.05 34.29,17.14 v34.29,8.26
L1
  Top 0.203: R21.1 57.78,26.04 J9.2
L2
  Top 0.203: R29.1 57.78,27.94 59.05,29.21 60.96,29.21 J9.1
L3
  Top 0.203: R30.1 59.05,29.84 J9.4
LED1  (via drill 0.5)
  Top 0.203: v41.27,26.67 52.7,26.67 53.34,26.04 R21.2 | IC4.13 26.46,36.41 26.67,36.2 v26.67,34.92
  Bottom 0.203: v41.27,26.67 39.37,28.57 31.11,28.57 26.67,33.02 v26.67,34.92
LED2  (via drill 0.5)
  Top 0.203: IC4.12 27.09,37.04 v28.57,35.56 | v42.55,27.94 R29.2
  Bottom 0.203: v42.55,27.94 40.89,29.59 31.75,29.59 28.57,32.77 v28.57,35.56
LED3  (via drill 0.5)
  Top 0.203: IC4.11 27.59,37.17 27.94,36.83 28.57,36.83 v29.84,35.56 | R30.2 53.34,29.84 52.7,29.21 v43.81,29.21
  Bottom 0.203: v43.81,29.21 42.42,30.61 32.38,30.61 29.84,33.15 v29.84,35.56
LEDB
  Top 0.203: R13.1 14.23,23.76 16.51,26.04 16.51,30.48 18.29,32.26 22.23,32.26 23.37,33.41 IC4.19
LEDG
  Top 0.203: R14.1 14.23,27.57 15.24,28.57 15.24,31.75 17.02,33.53 21.46,33.53 22.34,34.41 IC4.17
LEDR
  Top 0.203: R15.1 14.23,25.66 15.88,27.3 15.88,31.11 17.65,32.89 21.84,32.89 22.86,33.91 IC4.18
LP1  (via drill 0.5)
  Top 0.203: IC7.1 20.69,38.1 R18.2 21.22,37.84 21.59,37.47 v21.59,36.83 | R27.1 16.77,43.45 v15.24,41.91
  Bottom 0.203: v15.24,41.91 15.24,38.73 17.14,36.83 v21.59,36.83
LP2
  Top 0.203: IC7.5 13.26,43.47 C39.1 14.71,43.55 R27.2
LS1  (via drill 0.5)
  Top 0.203: R44.1 R46.2 v50.8,11.43
  Bottom 0.203: v50.8,11.43 51.44,10.79 55.88,10.79 58.42,13.34 58.42,49.53 55.5,52.45 35.09,52.45 J2.22
LS2  (via drill 0.5)
  Top 0.203: R45.1 R47.2 54.61,11.43 v55.88,12.7 | v41.91,50.8 40.26,52.45 30.01,52.45 J2.18
  Bottom 0.203: v55.88,12.7 57.15,13.97 57.15,48.9 54.61,51.44 42.55,51.44 v41.91,50.8
MISO
  Top 0.203: IC4.40 40.66,32.41 45.72,37.47 48.26,37.47 50.8,40.01 R28.2
MOSI
  Top 0.203: IC4.41 39.26,32.91 50.16,43.81 R25.2
OSC32_IN
  Top 0.203: IC4.3 31.59,39.85 32.07,40.32 Y1.1 37.15,40.32 37.84,39.63 C8.1
OSC32_OUT
  Top 0.203: IC4.4 31.09,40.62 31.75,41.27 34.16,41.27 35.94,43.05 Y1.4 37.15,43.5 37.84,44.19 C9.1
OSC_IN
  Top 0.203: IC4.5 30.59,41.39 31.48,42.28 C7.1 31.48,44.24 Y2.P$1
OSC_OUT
  Top 0.203: IC4.6 30.09,41.66 29.48,42.28 C6.1 29.48,44.24 Y2.P$2
PG5
  Top 0.203: IC5.8 26.33,16.59 R9.1
R_RX  (via drill 0.5)
  Top 0.203: R43.1 20.32,49.78 19.81,50.29 19.81,52.58 18.62,53.77 J2.10 | IC4.42 38.48,33.41 v38.73,33.66
  Bottom 0.203: J2.10 18.62,53.77 19.81,52.58 19.81,50.29 20.57,49.53 24.77,49.53 32.38,41.91 32.38,39.37 36.2,35.56 36.83,35.56 v38.73,33.66
R_SCL
  Top 0.203: JP4.1 13.97,50.71 J2.5
R_SDA
  Top 0.203: J2.3 10.91,49.52 JP3.1
R_TX  (via drill 0.5)
  Top 0.203: IC4.43 35.94,33.91 v36.2,34.16
  Bottom 0.203: J2.8 17.27,52.49 17.27,49.4 18.41,48.26 24.13,48.26 31.11,41.27 31.11,39.37 36.32,34.16 v36.2,34.16
RC
  Top 0.203: D3.5 R15.2
RF_HX1
  Top 1.232: J6.SIG IC6.2
RGND
  pour Top (isolate 0.203, rank 3): 0.64,6.73 0.64,19.05 10.79,19.05 10.79,6.73
  pour Bottom (rank 3): 0.64,19.05 0.64,6.73 10.79,6.73 10.79,19.05
SCK
  Top 0.203: IC4.39 42.06,31.91 46.35,36.2 R4.2
SCL  (via drill 0.5)
  Top 0.203: JP4.2 15.37,48.39 v15.88,48.9 R5.1 | IC3.P$4 49.83,20.61 48.26,19.05 | IC8.14 48.26,19.05 | IC4.45 33.63,34.91 v33.02,34.29 | 48.26,19.05 47.51,19.8 D7.C v47.51,22.11 | v60.33,23.5 v55.24,23.5
  Bottom 0.203: v15.88,48.9 17.78,46.99 23.5,46.99 29.84,40.64 29.84,39.33 33.02,36.16 v33.02,34.29 35.05,32.26 42.42,32.26 43.81,33.66 47.62,33.66 48.9,32.38 48.9,24.77 | J9.5 60.96,31.75 60.96,24.13 v60.33,23.5 | v55.24,23.5 50.16,23.5 48.9,24.77 | v47.51,22.11 47.51,23.38 48.9,24.77
SDA  (via drill 0.5)
  Top 0.203: JP3.2 10.79,47.62 11.43,46.99 v15.88,46.99 R8.1 | IC3.P$3 50.48,20 50.16,19.68 | 50.16,19.68 49.36,18.88 IC8.13 | IC4.46 31.91,35.41 v31.75,35.56 | 50.16,19.68 50.8,19.05 v55.24,19.05 56.63,19.05 | v60.33,19.05 56.63,19.05 | 56.63,19.05 D5.C
  Bottom 0.203: v15.88,46.99 17.14,45.72 22.86,45.72 28.57,40.01 28.57,39.37 31.75,36.2 v31.75,35.56 31.75,33.02 33.53,31.24 43.31,31.24 44.45,32.38 46.99,32.38 47.62,31.75 47.62,25.4 45.72,23.5 45.72,21.59 46.99,20.32 53.98,20.32 v55.24,19.05 | v60.33,19.05 63.5,22.23 63.5,29.21 J9.3
SW5
  pour Top (isolate 0.203, rank 3, no thermals): 26.04,15.24 26.04,14.78 27.48,14.78 27.94,15.24 30.1,15.24 30.1,16.51 27.94,16.51 26.67,15.24
SWCLK
  Top 0.203: IC4.37 37.04,30.91 37.47,30.48 37.47,26.54 J5.1
SWDIO
  Top 0.203: IC4.34 31.59,26.82 32,26.42 32,25.02 31.5,24.51 29.59,24.51 28.57,23.5 J5.3
TEMP  (via drill 0.5)
  Top 0.203: J9.13 60.96,44.45 58.42,44.45 57.78,45.09 54.73,45.09 | 54.73,45.09 D6.C | IC4.28 28.59,28.59 27.94,27.94 27.94,25.77 R32.1 27.57,24.39 27.3,24.13 27.3,21.59 28.57,20.32 34.92,20.32 38.73,24.13 v41.91,24.13 | 54.73,45.09 54.61,45.09 53.98,44.45 53.98,31.37 53.72,31.11 52.7,31.11 52.07,30.48 v45.72,30.48
  Bottom 0.203: v45.72,30.48 45.72,27.94 v41.91,24.13
TXD
  Top 0.203: IC6.7 8.89,39.37 IC7.7 IC7.6
VBAT
  pour Top (isolate 0.305, rank 3): 19.05,1.91 19.05,14.99 22.23,14.99 22.23,13.97 21.34,13.97 21.34,10.92 27.94,10.92 27.94,5.08 26.04,3.17 26.04,1.91
VDDA
  Top 0.203: IC4.9 28.59,38.97 27.04,40.52 C4.1 27.04,40.91 25.53,42.41 L2.2 26.16,47.62 26.67,47.62 27.04,47.99 C5.1
VDIV  (via drill 0.5)
  Top 0.203: v15.88,14.61 R20.2 16.88,12.96 17.52,12.33 R19.1 | IC4.15 21.43,35.41 20.95,34.92 v19.68,34.92
  Bottom 0.203: v15.88,14.61 18.41,17.14 25.4,17.14 26.04,17.78 26.04,20.32 25.4,20.95 22.23,20.95 20.95,22.23 20.95,33.66 v19.68,34.92
VS
  Top 0.203: IC3.P$8 51.77,22.57 51.12,21.91 IC3.P$2 51.12,20.63 51.8,19.95 C16.1
  Top 0.61: J9.11 63.5,40.64
  pour Top (isolate 0.305, rank 2): 42.16,10.16 45.09,10.16 45.09,12.06 48.26,12.06 48.9,12.7 48.9,13.34 43.81,13.34 43.81,17.14 47.62,17.14 47.62,23.11 49.53,23.11 49.53,23.5 50.8,23.5 50.8,23.88 51.44,23.88 51.44,23.5 52.07,23.5 52.07,27.3 50.16,26.04 47.62,26.04 47.62,24.13 46.35,24.13 45.72,23.5 45.72,19.05 45.09,18.41 43.18,18.41 42.16,17.4
  pour Top: 53.34,20.32 53.34,19.68 60.96,19.68 64.14,22.86 64.14,48.9 61.59,48.9 61.59,47.62 62.87,47.62 63.5,46.99 63.5,25.4 59.05,20.95 53.98,20.95

### Text on the board
tPlace: 5V | 5V | TXO | RXI | GND | LS2 | GND | LS1 | IF FOUND: | 301-956-5041 | GND | BUTTON | 1 | L1 L3 CS 3.3V SCK MISO MOSI GND | L2 SDA SCL 3.3V GND VS TEMP GND | 1 | !RST! DIO GND CLK | 1 | RESET | 1
bPlace: Make it your pastime / Make it your mission / Go ECE! | Microsoft Maker Garage | Project Phoenix | REV A